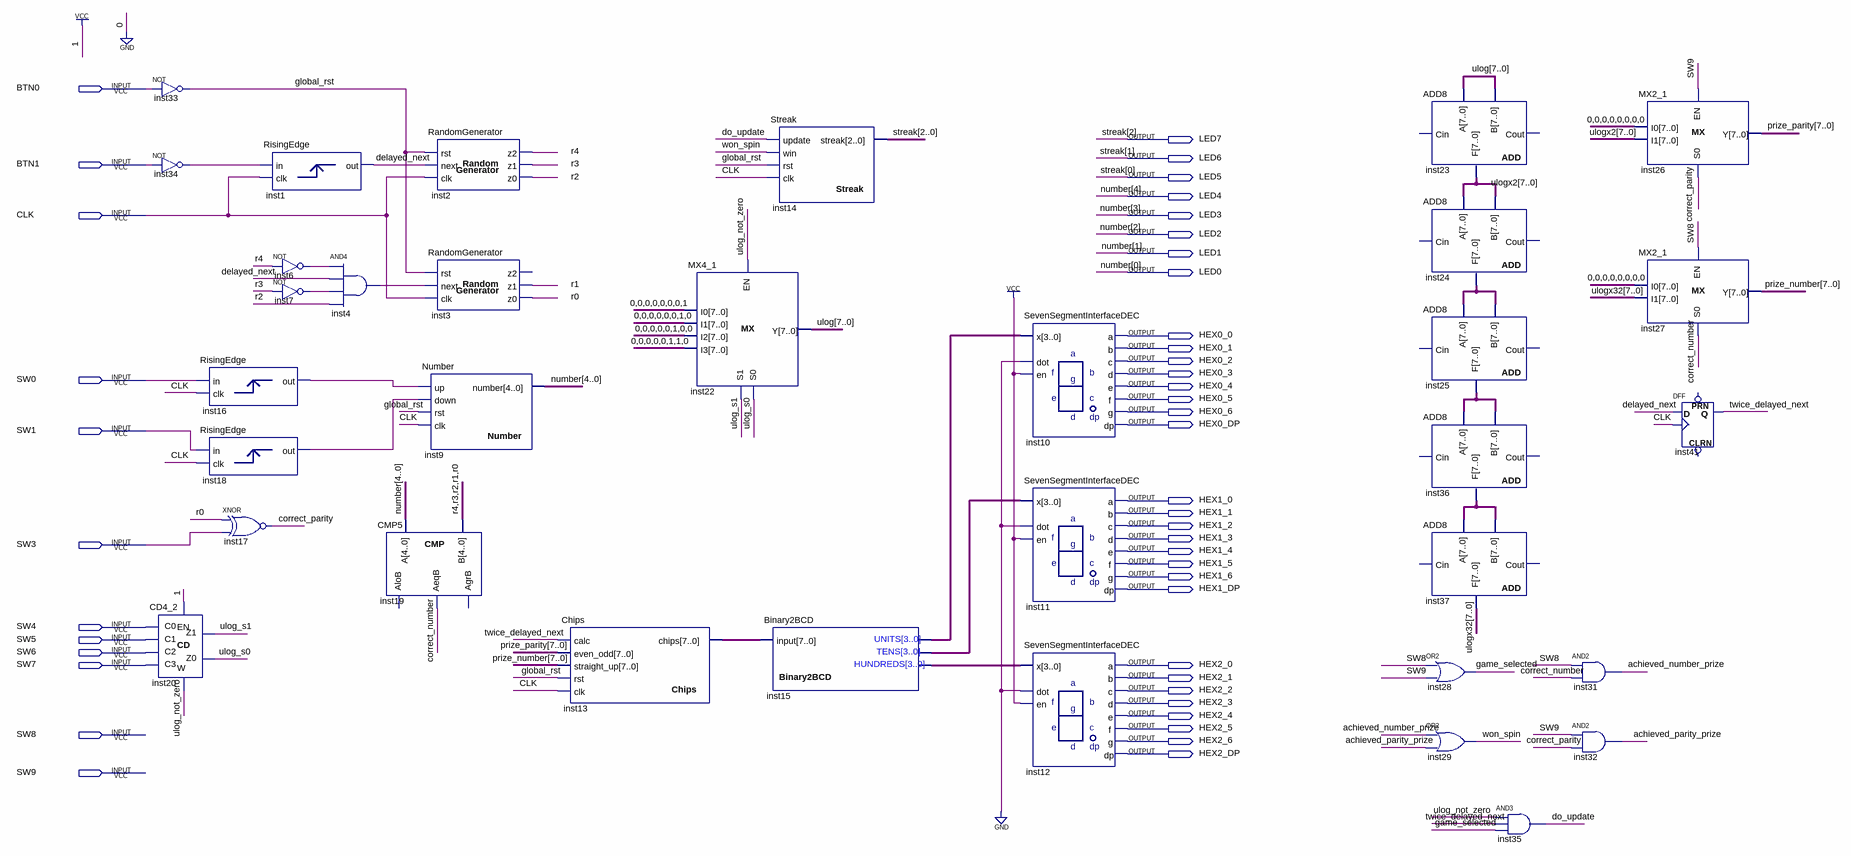
[diagram p0: schematic sheet]
// Quartus schematic PORT_LAB4.bdf as structural Verilog: 34 symbols, 44 pins
module PORT_LAB4 (
  input  BTN0,
  input  BTN1,
  input  CLK,
  input  SW0,
  input  SW1,
  input  SW3,
  input  SW4,
  input  SW5,
  input  SW6,
  input  SW7,
  input  SW8,
  input  SW9,
  output LED7,
  output LED6,
  output LED5,
  output LED4,
  output LED3,
  output LED2,
  output LED1,
  output LED0,
  output HEX0_0,
  output HEX0_1,
  output HEX0_2,
  output HEX0_3,
  output HEX0_4,
  output HEX0_5,
  output HEX0_6,
  output HEX0_DP,
  output HEX1_0,
  output HEX1_1,
  output HEX1_2,
  output HEX1_3,
  output HEX1_4,
  output HEX1_5,
  output HEX1_6,
  output HEX1_DP,
  output HEX2_0,
  output HEX2_1,
  output HEX2_2,
  output HEX2_3,
  output HEX2_4,
  output HEX2_5,
  output HEX2_6,
  output HEX2_DP
);

  wire achieved_number_prize, achieved_parity_prize, correct_number, correct_parity, delayed_next, do_update,
       game_selected, global_rst, inst4_out, inst6_out, inst7_out, inst16_output, inst18_output, inst34_out,
       r0, r1, r2, r3, r4, twice_delayed_next, ulog_not_zero, ulog_s0, ulog_s1, won_spin;
  wire [3:0] inst15_bcd_hundreds, inst15_bcd_tens, inst15_bcd_units;
  wire [7:0] inst13_chips, inst24_f, inst25_f, inst36_f, prize_number, prize_parity, ulog, ulogx2, ulogx32;

  not inst33 (global_rst, BTN0);
  not inst34 (inst34_out, BTN1);
  CD4_2 inst20 (.C0(SW4), .C1(SW5), .C2(SW6), .C3(SW7), .EN(1'b1), .Z0(ulog_s0), .Z1(ulog_s1), .W(ulog_not_zero));
  RisingEdge inst16 (.clk(CLK), .\input (SW0), .\output (inst16_output));
  RisingEdge inst18 (.clk(CLK), .\input (SW1), .\output (inst18_output));
  RisingEdge inst1 (.clk(CLK), .\input (inst34_out), .\output (delayed_next));
  xnor inst17 (correct_parity, r0, SW3);
  not inst6 (inst6_out, r4);
  not inst7 (inst7_out, r3);
  and inst4 (inst4_out, inst6_out, delayed_next, inst7_out, r2);
  CMP5 inst19 (
    .A({LED4, LED3, LED2, LED1, LED0}), .B({r4, r3, r2, r1, r0}), .AeqB(correct_number));  // open: AgrB, AloB
  RandomGenerator inst2 (.NXT(delayed_next), .RST(global_rst), .CLK(CLK), .Z2(r4), .Z1(r3), .Z0(r2));
  RandomGenerator inst3 (.NXT(inst4_out), .RST(global_rst), .CLK(CLK), .Z1(r1), .Z0(r0));  // open: Z2
  Number inst9 (
    .up(inst16_output), .down(inst18_output), .rst(global_rst), .clk(CLK),
    .number({LED4, LED3, LED2, LED1, LED0}));
  Chips inst13 (
    .calc(twice_delayed_next), .even_odd(prize_parity), .straight_up(prize_number), .rst(global_rst),
    .clk(CLK), .chips(inst13_chips));
  MX4_1 inst22 (
    .I3(8'b00000110), .I2(8'b00000100), .I1(8'b00000010), .I0(8'b00000001), .S1(ulog_s1), .S0(ulog_s0),
    .EN(ulog_not_zero), .Y(ulog));
  Streak inst14 (.update(do_update), .win(won_spin), .rst(global_rst), .clk(CLK), .streak({LED7, LED6, LED5}));
  Binary2BCD inst15 (
    .\input (inst13_chips), .bcd_hundreds(inst15_bcd_hundreds), .bcd_tens(inst15_bcd_tens),
    .bcd_units(inst15_bcd_units));
  SevenSegmentInterfaceDEC inst10 (
    .dot(1'b0), .en(1'b1), .x(inst15_bcd_units), .a(HEX0_0), .b(HEX0_1), .c(HEX0_2), .d(HEX0_3), .e(HEX0_4),
    .f(HEX0_5), .g(HEX0_6), .dp(HEX0_DP));
  SevenSegmentInterfaceDEC inst11 (
    .dot(1'b0), .en(1'b1), .x(inst15_bcd_tens), .a(HEX1_0), .b(HEX1_1), .c(HEX1_2), .d(HEX1_3), .e(HEX1_4),
    .f(HEX1_5), .g(HEX1_6), .dp(HEX1_DP));
  SevenSegmentInterfaceDEC inst12 (
    .dot(1'b0), .en(1'b1), .x(inst15_bcd_hundreds), .a(HEX2_0), .b(HEX2_1), .c(HEX2_2), .d(HEX2_3),
    .e(HEX2_4), .f(HEX2_5), .g(HEX2_6), .dp(HEX2_DP));
  ADD8 inst23 (.A(ulog), .B(ulog), .F(ulogx2));  // open: Cin, Cout
  ADD8 inst24 (.A(ulogx2), .B(ulogx2), .F(inst24_f));  // open: Cin, Cout
  ADD8 inst25 (.A(inst24_f), .B(inst24_f), .F(inst25_f));  // open: Cin, Cout
  ADD8 inst36 (.A(inst25_f), .B(inst25_f), .F(inst36_f));  // open: Cin, Cout
  ADD8 inst37 (.A(inst36_f), .B(inst36_f), .F(ulogx32));  // open: Cin, Cout
  or inst28 (game_selected, SW8, SW9);
  or inst29 (won_spin, achieved_number_prize, achieved_parity_prize);
  and inst35 (do_update, ulog_not_zero, twice_delayed_next, game_selected);
  and inst31 (achieved_number_prize, SW8, correct_number);
  and inst32 (achieved_parity_prize, SW9, correct_parity);
  MX2_1 inst26 (.I1(ulogx2), .I0({8{1'b0}}), .S0(correct_parity), .EN(SW9), .Y(prize_parity));
  MX2_1 inst27 (.I1(ulogx32), .I0({8{1'b0}}), .S0(correct_number), .EN(SW8), .Y(prize_number));
  DFF inst41 (.CLK(CLK), .D(delayed_next), .Q(twice_delayed_next));  // open: CLRN, PRN

  // Other names for the same wires on the sheet: number[4:0] = {LED4, LED3, LED2, LED1, LED0};
  //   streak[2:0] = {LED7, LED6, LED5}
endmodule
